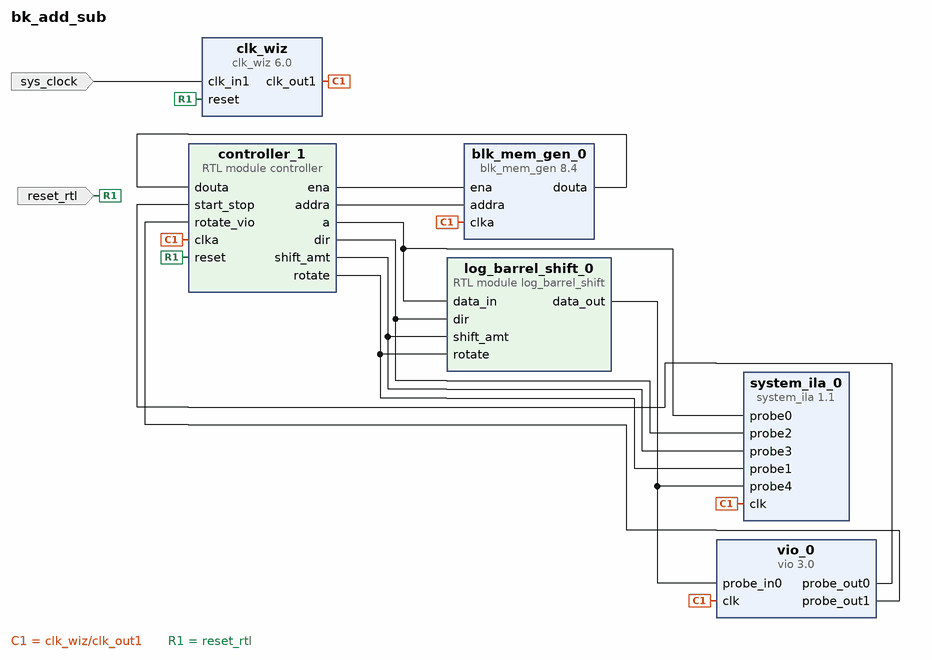
[diagram p0: block diagram of the top level]
# Vivado block design bk_add_sub, xc7z020clg400-1, Vivado 2020.2
create_bd_design bk_add_sub

create_bd_port -dir I -type clk sys_clock
set_property -dict {CONFIG.FREQ_HZ 125000000 CONFIG.PHASE 0.000} [get_bd_ports sys_clock]
create_bd_port -dir I -type rst reset_rtl
set_property -dict {CONFIG.POLARITY ACTIVE_HIGH} [get_bd_ports reset_rtl]

create_bd_cell -type ip -vlnv xilinx.com:ip:system_ila:1.1 system_ila_0
set_property -dict [list \
  CONFIG.C_MON_TYPE NATIVE \
  CONFIG.C_NUM_OF_PROBES 5 \
  CONFIG.C_PROBE0_WIDTH 8 \
  CONFIG.C_PROBE1_WIDTH 1 \
  CONFIG.C_PROBE2_WIDTH 1 \
  CONFIG.C_PROBE3_WIDTH 3 \
  CONFIG.C_PROBE4_WIDTH 8 \
  CONFIG.C_PROBE_WIDTH_PROPAGATION MANUAL \
] [get_bd_cells system_ila_0]
create_bd_cell -type ip -vlnv xilinx.com:ip:vio:3.0 vio_0
set_property -dict [list \
  CONFIG.C_NUM_PROBE_IN 1 \
  CONFIG.C_NUM_PROBE_OUT 2 \
  CONFIG.C_PROBE_OUT0_INIT_VAL 0x1 \
  CONFIG.C_PROBE_OUT3_WIDTH 3 \
] [get_bd_cells vio_0]
create_bd_cell -type ip -vlnv xilinx.com:ip:blk_mem_gen:8.4 blk_mem_gen_0
set_property -dict [list \
  CONFIG.Coe_File ../../../../../../../../test_vector.coe \
  CONFIG.Enable_32bit_Address false \
  CONFIG.Load_Init_File true \
  CONFIG.Operating_Mode_A WRITE_FIRST \
  CONFIG.Read_Width_A 12 \
  CONFIG.Register_PortA_Output_of_Memory_Core true \
  CONFIG.Register_PortA_Output_of_Memory_Primitives true \
  CONFIG.Use_Byte_Write_Enable false \
  CONFIG.Use_RSTA_Pin false \
  CONFIG.Write_Depth_A 16 \
  CONFIG.Write_Width_A 12 \
  CONFIG.use_bram_block Stand_Alone \
] [get_bd_cells blk_mem_gen_0]
create_bd_cell -type ip -vlnv xilinx.com:ip:clk_wiz:6.0 clk_wiz
set_property -dict {CONFIG.CLK_IN1_BOARD_INTERFACE sys_clock CONFIG.USE_BOARD_FLOW true} [get_bd_cells clk_wiz]
create_bd_cell -type module -reference log_barrel_shift log_barrel_shift_0
create_bd_cell -type module -reference controller controller_1

# ---- connections ----

connect_bd_net [get_bd_pins blk_mem_gen_0/douta] [get_bd_pins controller_1/douta]
connect_bd_net [get_bd_pins vio_0/probe_out0] [get_bd_pins controller_1/start_stop]
connect_bd_net [get_bd_pins clk_wiz/clk_out1] \
  [get_bd_pins system_ila_0/clk] [get_bd_pins vio_0/clk] [get_bd_pins blk_mem_gen_0/clka] [get_bd_pins controller_1/clka]
connect_bd_net [get_bd_ports sys_clock] [get_bd_pins clk_wiz/clk_in1]
connect_bd_net [get_bd_ports reset_rtl] [get_bd_pins clk_wiz/reset] [get_bd_pins controller_1/reset]
connect_bd_net [get_bd_pins controller_1/a] [get_bd_pins log_barrel_shift_0/data_in] [get_bd_pins system_ila_0/probe0]
connect_bd_net [get_bd_pins controller_1/dir] [get_bd_pins log_barrel_shift_0/dir] [get_bd_pins system_ila_0/probe2]
connect_bd_net [get_bd_pins log_barrel_shift_0/data_out] [get_bd_pins system_ila_0/probe4] [get_bd_pins vio_0/probe_in0]
connect_bd_net [get_bd_pins controller_1/shift_amt] [get_bd_pins system_ila_0/probe3] [get_bd_pins log_barrel_shift_0/shift_amt]
connect_bd_net [get_bd_pins controller_1/rotate] [get_bd_pins log_barrel_shift_0/rotate] [get_bd_pins system_ila_0/probe1]
connect_bd_net [get_bd_pins controller_1/ena] [get_bd_pins blk_mem_gen_0/ena]
connect_bd_net [get_bd_pins controller_1/addra] [get_bd_pins blk_mem_gen_0/addra]
connect_bd_net [get_bd_pins vio_0/probe_out1] [get_bd_pins controller_1/rotate_vio]

validate_bd_design
save_bd_design
